# Altium schematic sheet AVR.SchDoc: Gyroscopes Buffer
size A4; ApprovedBy: Piotr Kuligowski; CheckedBy: Piotr Kuligowski; Author: Michał Gumiela; SheetNumber: 10; SheetTotal: 13
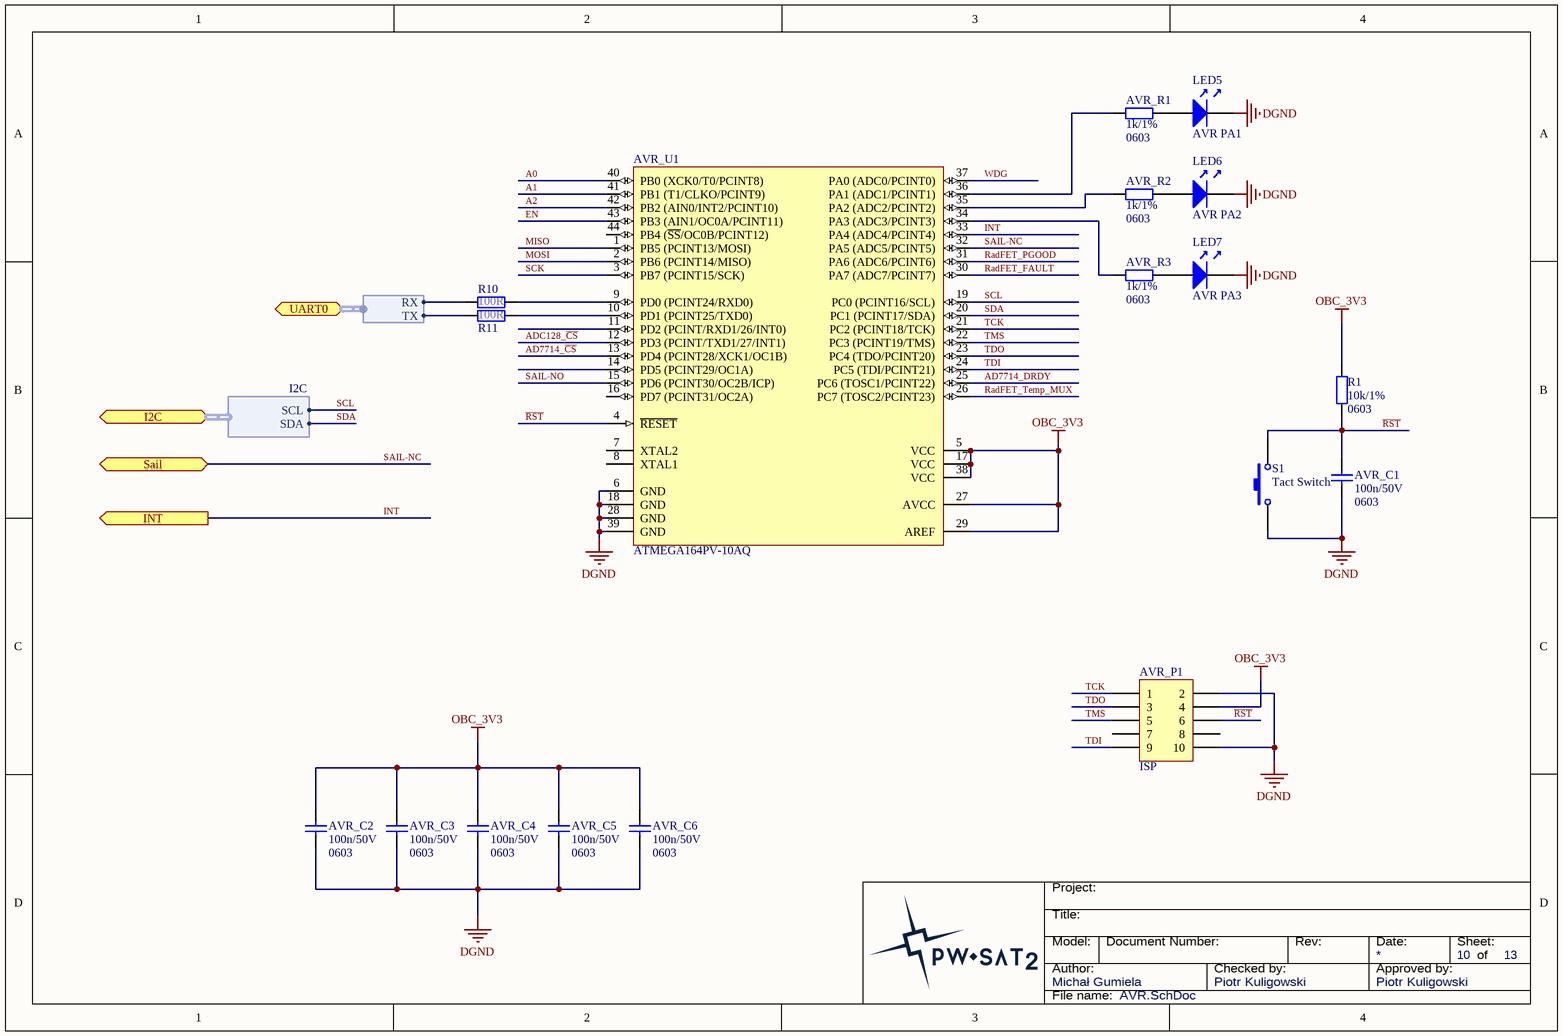
[diagram p0: AVR.SchDoc]

## Parts
AVR_C1  Package: 0603  [SMD_Capacitor_0603]  (hidden comment: 100n/50V)
AVR_C2  Package: 0603  [SMD_Capacitor_0603]  (hidden comment: 100n/50V)
AVR_C3  Package: 0603  [SMD_Capacitor_0603]  (hidden comment: 100n/50V)
AVR_C4  Package: 0603  [SMD_Capacitor_0603]  (hidden comment: 100n/50V)
AVR_C5  Package: 0603  [SMD_Capacitor_0603]  (hidden comment: 100n/50V)
AVR_C6  Package: 0603  [SMD_Capacitor_0603]  (hidden comment: 100n/50V)
AVR_P1  ISP  [IDC-10-Male-Socket]
AVR_R1  Package: 0603  [SMD_Resistor_0603]  (hidden comment: 1k/1%)
AVR_R2  Package: 0603  [SMD_Resistor_0603]  (hidden comment: 1k/1%)
AVR_R3  Package: 0603  [SMD_Resistor_0603]  (hidden comment: 1k/1%)
AVR_U1  ATMEGA164PV-10AQ  [TQFP-44]
LED5  AVR PA1  [SMD_LED_1206]
LED6  AVR PA2  [SMD_LED_1206]
LED7  AVR PA3  [SMD_LED_1206]
R1  Package: 0603  [SMD_Resistor_0603]  (hidden comment: 10k/1%)
R10  100R  [SMD_Resistor_0603]
R11  100R  [SMD_Resistor_0603]
S1  Tact Switch  [Tact Switch 3x6]

## Ports
I2C (harness I2C), INT (out), Sail, UART0 (harness UART)

## Harnesses
I2C: SDA, SCL
UART: TX, RX

## Nets
DGND: AVR_C1.2 AVR_C2.2 AVR_C3.2 AVR_C4.2 AVR_C5.2 AVR_C6.2 AVR_P1.2 AVR_P1.10 AVR_U1.6(GND) AVR_U1.18(GND) AVR_U1.28(GND) AVR_U1.39(GND) LED5.K LED6.K LED7.K S1.2
OBC_3V3: AVR_C2.1 AVR_C3.1 AVR_C4.1 AVR_C5.1 AVR_C6.1 AVR_P1.4 AVR_U1.5(VCC) AVR_U1.17(VCC) AVR_U1.27(AVCC) AVR_U1.29(AREF) AVR_U1.38(VCC) R1.1
A0: AVR_U1.40(PB0_(XCK0/T0/PCINT8))
A1: AVR_U1.41(PB1_(T1/CLKO/PCINT9))
A2: AVR_U1.42(PB2_(AIN0/INT2/PCINT10))
AD7714_~{CS}: AVR_U1.13(PD4_(PCINT28/XCK1/OC1B))
AD7714_DRDY: AVR_U1.25(PC6_(TOSC1/PCINT22))
ADC128_~{CS}: AVR_U1.12(PD3_(PCINT/TXD1/27/INT1))
EN: AVR_U1.43(PB3_(AIN1/OC0A/PCINT11))
INT: AVR_U1.33(PA4_(ADC4/PCINT4)) ; port INT
MISO: AVR_U1.1(PB5_(PCINT13/MOSI))
MOSI: AVR_U1.2(PB6_(PCINT14/MISO))
~{RST}: AVR_C1.1 AVR_P1.6 AVR_U1.4(~{RESET}) R1.2 S1.1
RadFET_FAULT: AVR_U1.30(PA7_(ADC7/PCINT7))
RadFET_PGOOD: AVR_U1.31(PA6_(ADC6/PCINT6))
RadFET_Temp_MUX: AVR_U1.26(PC7_(TOSC2/PCINT23))
SAIL-NC: AVR_U1.32(PA5_(ADC5/PCINT5)) ; port Sail
SAIL-NO: AVR_U1.15(PD6_(PCINT30/OC2B/ICP))
SCK: AVR_U1.3(PB7_(PCINT15/SCK))
SCL: AVR_U1.19(PC0_(PCINT16/SCL)) ; port I2C.SCL
SDA: AVR_U1.20(PC1_(PCINT17/SDA)) ; port I2C.SDA
TCK: AVR_P1.1 AVR_U1.21(PC2_(PCINT18/TCK))
TDI: AVR_P1.9 AVR_U1.24(PC5_(TDI/PCINT21))
TDO: AVR_P1.3 AVR_U1.23(PC4_(TDO/PCINT20))
TMS: AVR_P1.5 AVR_U1.22(PC3_(PCINT19/TMS))
WDG: AVR_U1.37(PA0_(ADC0/PCINT0))
NetAVR_R1_1: AVR_R1.1 AVR_U1.36(PA1_(ADC1/PCINT1))
NetAVR_R1_2: AVR_R1.2 LED5.A
NetAVR_R2_1: AVR_R2.1 AVR_U1.35(PA2_(ADC2/PCINT2))
NetAVR_R2_2: AVR_R2.2 LED6.A
NetAVR_R3_1: AVR_R3.1 AVR_U1.34(PA3_(ADC3/PCINT3))
NetAVR_R3_2: AVR_R3.2 LED7.A
NetAVR_U1_9: AVR_U1.9(PD0_(PCINT24/RXD0)) R10.2
NetAVR_U1_10: AVR_U1.10(PD1_(PCINT25/TXD0)) R11.2
NetR10_1: R10.1 ; port UART0.RX
NetR11_1: R11.1 ; port UART0.TX

Not connected (* = marked no-connect by the designer): AVR_P1 7 8; AVR_U1 7(XTAL2) 8(XTAL1) 11(PD2_(PCINT/RXD1/26/INT0)) 14(PD5_(PCINT29/OC1A)) 16(PD7_(PCINT31/OC2A)) 44(PB4_(~{SS}/OC0B/PCINT12))

## Notes on the sheet
- Title:
- Project:
- Author:
- Model:
- Document Number:
- Checked by:
- Rev:
- Date:
- Approved by:
- Sheet:
- of
- File name:

## Library data of the parts
AVR_C1-AVR_C6 = Cer_C0603T104K5RALTU: Ceramic Cap Kemet COTS 100n/50V X7R 0603; Manufacturer: Kemet; ManufacturerPartNumber: C0603T104K5RALTU; Value: 100n/50V
AVR_P1 = Header 5X2: Header, 5-Pin, Dual row
AVR_R1-AVR_R3 = CRCW06031K00FKxxxx: 1k/1% Vishay CRCW 0603 Resistor. 100mW, 100ppm, 75V.; Manufacturer: Vishay; ManufacturerPartNumber: CRCW06031K00FKxxxx; Value: 1k/1%
AVR_U1 = ATMEGA164PV-10AQ: General-purpose microcontroller; Value: ATMEGA164PV-10AQ
LED5-LED7 = LED-1206_RED: LED diode, SMD1206 package.; Supplier 1: Farnell; Farnell: 1581229
  LED5: Value: AVR PA1
  LED6: Value: AVR PA2
  LED7: Value: AVR PA3
R1 R10 R11 = CRCW060310K0FKxxxx: 10k/1% Vishay CRCW 0603 Resistor. 100mW, 100ppm, 75V.; Manufacturer: Vishay; ManufacturerPartNumber: CRCW060310K0FKxxxx
  R1: Value: 10k/1%
  R10 R11: Value: 100R; Package: 0603
S1 = TactSwitch: Supplier 1: Farnell